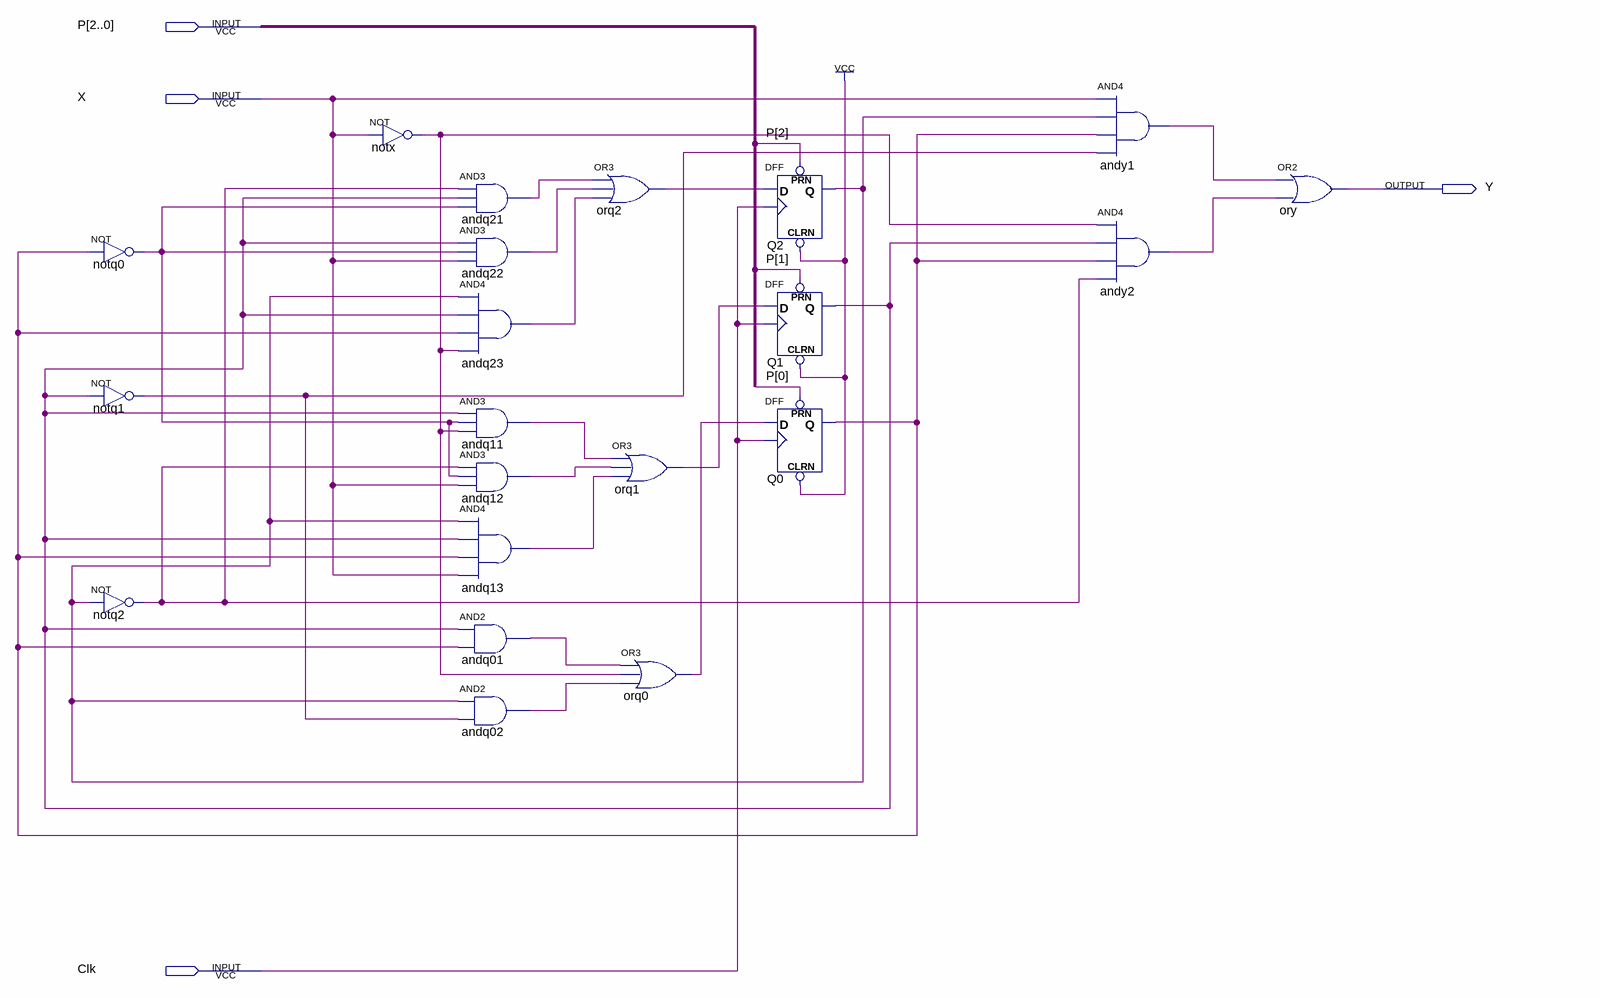
[diagram p0: schematic sheet]
// Quartus schematic SeqDet3in5.bdf as structural Verilog: 21 symbols, 4 pins
module SeqDet3in5 (
  input  [2:0] P,
  input  X,
  input  Clk,
  output Y
);

  wire andq01_out, andq02_out, andq11_out, andq12_out, andq13_out, andq21_out, andq22_out, andq23_out,
       andy1_out, andy2_out, notq0_out, notq1_out, notq2_out, notx_out, orq0_out, orq1_out, orq2_out, Q0_q,
       Q1_q, Q2_q;

  not notq0 (notq0_out, Q0_q);
  not notq1 (notq1_out, Q1_q);
  not notq2 (notq2_out, Q2_q);
  not notx (notx_out, X);
  and andq21 (andq21_out, notq2_out, Q1_q, notq0_out);
  and andq22 (andq22_out, Q1_q, notq0_out, X);
  and andq23 (andq23_out, Q2_q, Q1_q, Q0_q, notx_out);
  and andq11 (andq11_out, Q1_q, notq0_out, notx_out);
  and andq12 (andq12_out, notq2_out, notq0_out, X);
  and andq13 (andq13_out, Q2_q, Q1_q, Q0_q, X);
  and andq01 (andq01_out, Q1_q, Q0_q);
  and andq02 (andq02_out, Q2_q, notq1_out);
  or orq2 (orq2_out, andq21_out, andq22_out, andq23_out);
  or orq1 (orq1_out, andq11_out, andq12_out, andq13_out);
  or orq0 (orq0_out, andq01_out, notx_out, andq02_out);
  DFF Q2 (.CLRN(1'b1), .CLK(Clk), .D(orq2_out), .PRN(P[2]), .Q(Q2_q));
  DFF Q1 (.CLRN(1'b1), .CLK(Clk), .D(orq1_out), .PRN(P[1]), .Q(Q1_q));
  DFF Q0 (.CLRN(1'b1), .CLK(Clk), .D(orq0_out), .PRN(P[0]), .Q(Q0_q));
  and andy1 (andy1_out, X, Q2_q, Q0_q, notq1_out);
  and andy2 (andy2_out, notx_out, Q1_q, Q0_q, notq2_out);
  or ory (Y, andy1_out, andy2_out);
endmodule
